# Altium schematic sheet CAN.SchDoc: CAN
size A4; DocumentNumber: 2; SheetNumber: 2; SheetTotal: 6
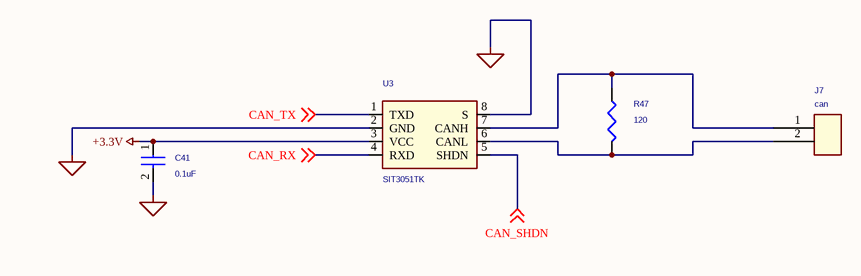
[diagram p0: CAN.SchDoc]

## Parts
C41  0.1uF  [C_0402]
J7  can  [SOLDER_PAD_2PIN_SMD]
R47  120  [R_0402]
U3  SIT3051TK  [sot23-8p65_280x145l45x30n]

## Nets
+3.3V: C41.1 U3.3(VCC)
GND_SIGNAL: C41.2 U3.2(GND) U3.8(S)
CAN_RX: U3.4(RXD) ; off-sheet CAN_RX
CAN_SHDN: U3.5(SHDN) ; off-sheet CAN_SHDN
CAN_TX: U3.1(TXD) ; off-sheet CAN_TX
NetJ7_1: J7.1 R47.1 U3.7(CANH)
NetJ7_2: J7.2 R47.2 U3.6(CANL)

## Notes on the sheet
- Title:
- Project:
- Size:
- Revision:
- Variant:
- A4
- -
- Date:
- Reference:
- Sheet:
- of

## Library data of the parts
C41 = CAP_Dup1: CAP CER 0.1UF 16V X7R 0402; PART_NUMBER: CAP-00000053; Manufacturer: Wurth Electronics Inc.; Manufacturer PN: 885012205037; Dielectric Type: Capacitors; Tolerance: 10%; CLASS: DISCRETE; Package Size: 0402 (1005 Metric); Temperature Coefficient: X7R; Rated Voltage: 16V
J7 = CON4_3: SOLDER PADS
R47 = RES: RES SMD 120 OHM 1% 1/16W 0402; PART_NUMBER: TMP-441; Manufacturer: Yageo; Manufacturer PN: RC0402FR-07120RL; Temperature Coefficient: 100ppm/C; Rated Power: 0.063W, 1/16W; CLASS: DISCRETE; Package Size: 0402 (1005 Metric); Tolerance: 1%
U3 = TCAN330: IC TXRX CAN 3.3V SOT-23; PART_NUMBER: TMP-379; Manufacturer: Texas Instruments; Manufacturer PN: TCAN330DCNT; Supply Voltage: 3 V ~ 3.6 V; Package Size: SOT-23-8; CLASS: IC